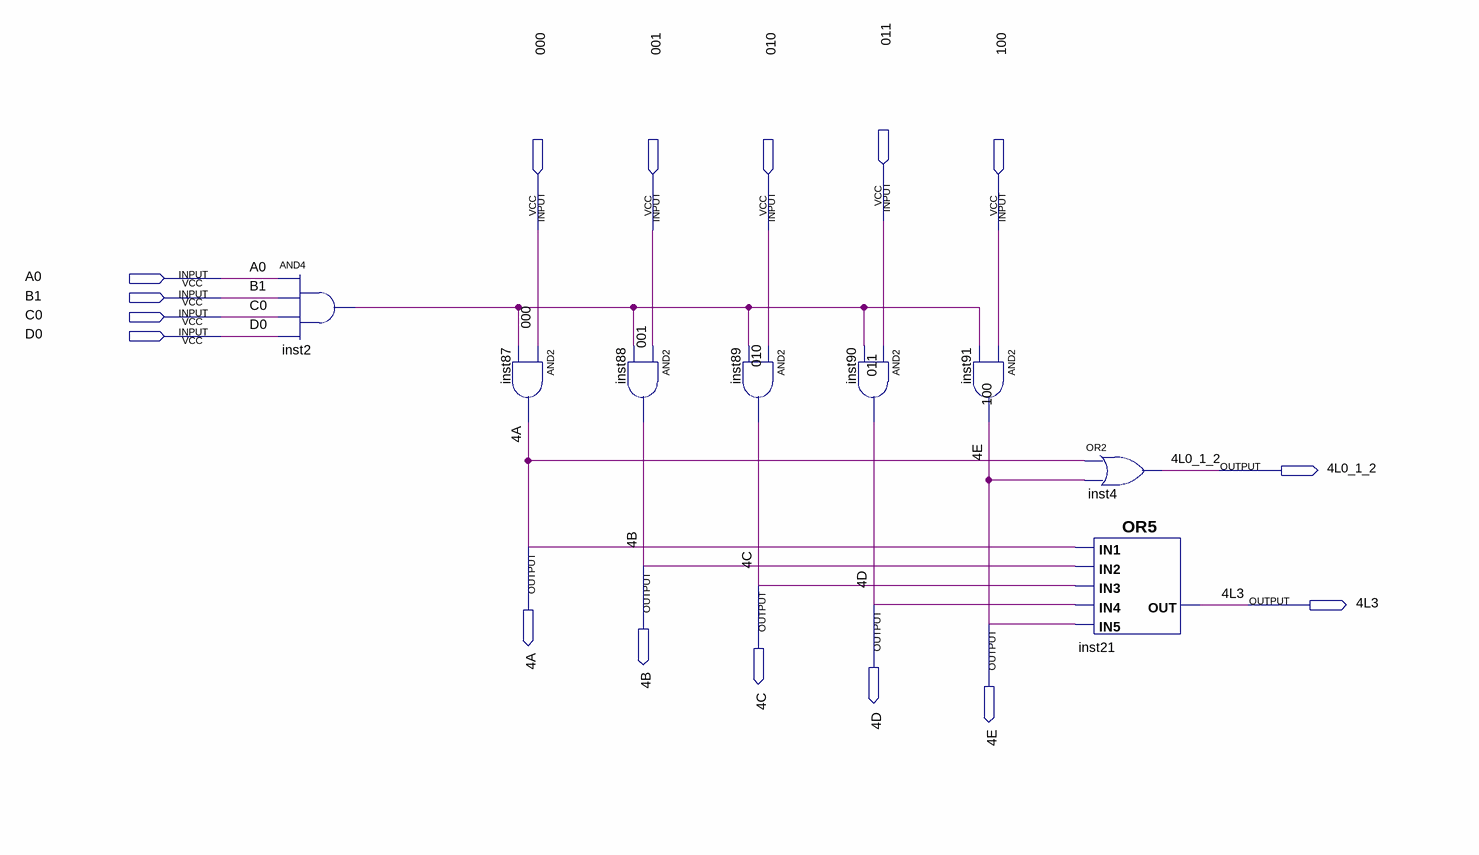
[diagram p0: schematic sheet]
// Quartus schematic carac4.bdf as structural Verilog: 8 symbols, 16 pins
module carac4 (
  input  \011 ,
  input  \000 ,
  input  \001 ,
  input  \010 ,
  input  \100 ,
  input  A0,
  input  B1,
  input  C0,
  input  D0,
  output \4L0_1_2 ,
  output \4A ,
  output \4B ,
  output \4C ,
  output \4D ,
  output \4L3 ,
  output \4E 
);

  wire inst2_out;

  and inst2 (inst2_out, A0, B1, C0, D0);
  and inst87 (\4A , \000 , inst2_out);
  and inst88 (\4B , \001 , inst2_out);
  and inst89 (\4C , \010 , inst2_out);
  and inst90 (\4D , \011 , inst2_out);
  and inst91 (\4E , \100 , inst2_out);
  or inst4 (\4L0_1_2 , \4A , \4E );
  or inst21 (\4L3 , \4A , \4B , \4C , \4D , \4E );
endmodule
